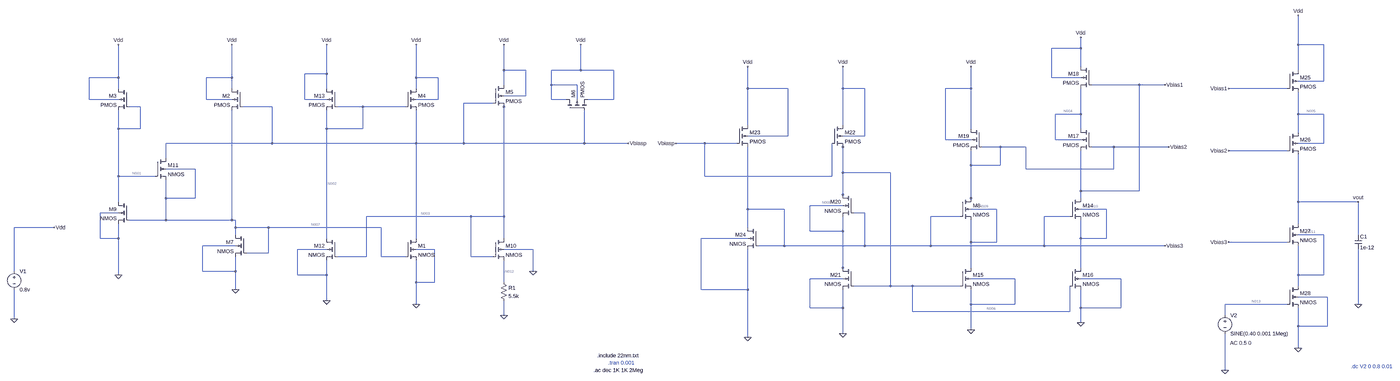
[diagram p0: schematic 22nm_Circuit.asc, whole sheet]
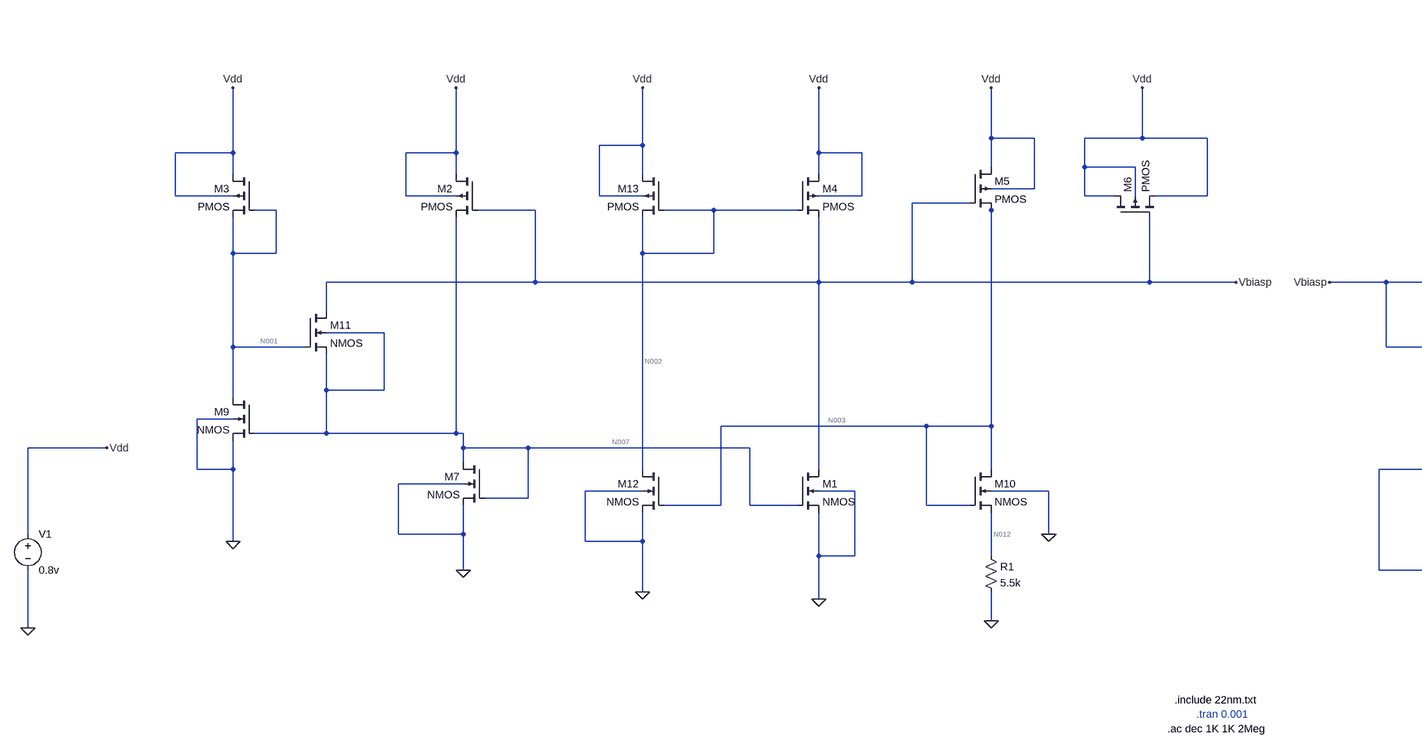
[diagram p1: schematic 22nm_Circuit.asc, part, row 1 of 1, column 1 of 2]
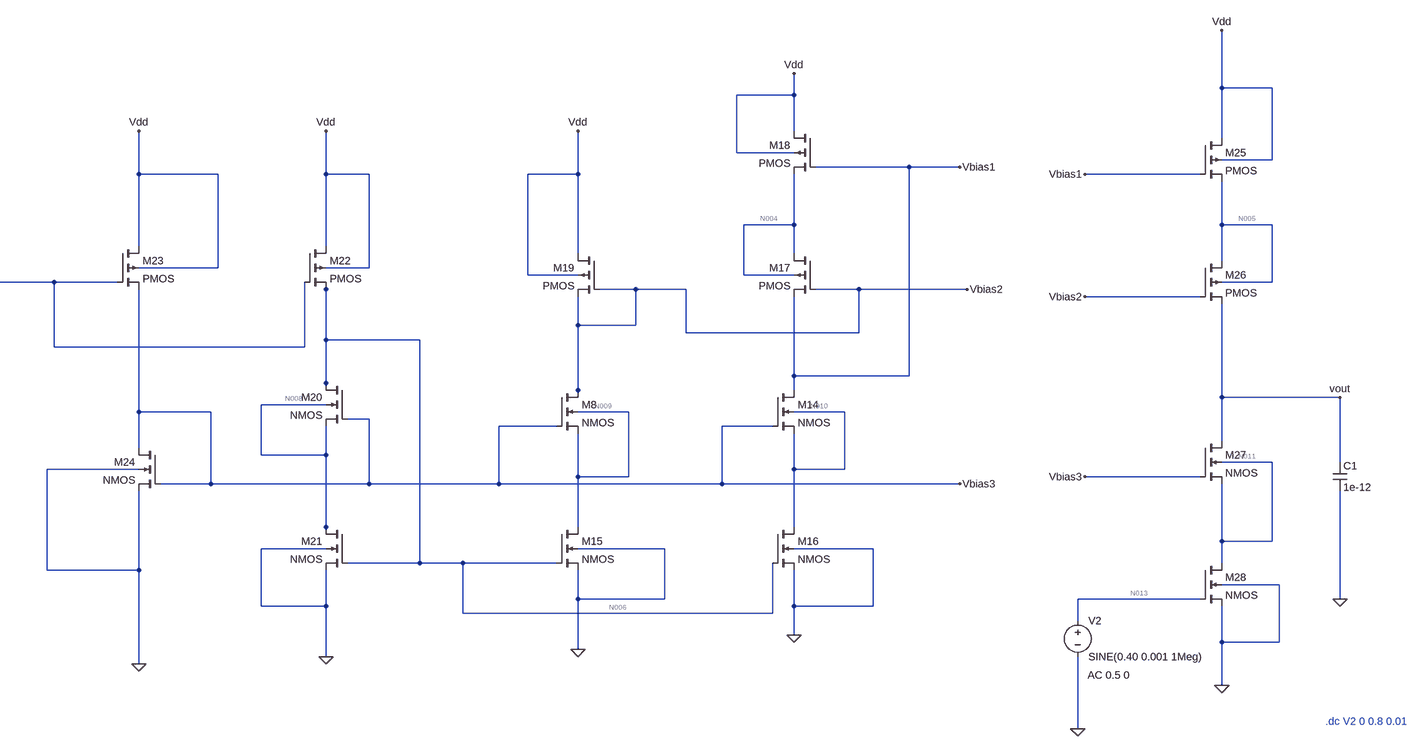
[diagram p2: schematic 22nm_Circuit.asc, part, row 1 of 1, column 2 of 2]
22nm_Circuit.asc, the LTspice schematic file:
Version 4
SHEET 1 9412 4424
WIRE 5104 240 5104 112
WIRE 5216 240 5104 240
WIRE 4112 256 4112 208
WIRE 4112 256 3984 256
WIRE 4112 336 4112 256
WIRE 1520 352 1520 240
WIRE 1616 352 1520 352
WIRE 1856 352 1856 240
WIRE 1856 352 1728 352
WIRE 2000 352 1856 352
WIRE 5104 352 5104 240
WIRE 672 368 672 240
WIRE 672 368 576 368
WIRE -320 384 -320 240
WIRE -320 384 -448 384
WIRE 176 384 176 240
WIRE 176 384 64 384
WIRE 1072 384 1072 240
WIRE 1168 384 1072 384
WIRE 3984 384 3984 256
WIRE 4112 384 3984 384
WIRE 5216 400 5216 240
WIRE 5216 400 5104 400
WIRE 1520 416 1520 352
WIRE 1728 416 1728 352
WIRE 1840 416 1728 416
WIRE 4368 416 4160 416
WIRE 4512 416 4368 416
WIRE -320 432 -320 384
WIRE 176 432 176 384
WIRE 672 432 672 368
WIRE 1072 432 1072 384
WIRE 2656 432 2656 336
WIRE 2832 432 2656 432
WIRE 3072 432 3072 336
WIRE 3168 432 3072 432
WIRE 3632 432 3632 336
WIRE 3632 432 3520 432
WIRE 5056 432 4800 432
WIRE 1616 464 1616 352
WIRE 1616 464 1520 464
WIRE -448 480 -448 384
WIRE -320 480 -448 480
WIRE 64 480 64 384
WIRE 176 480 64 480
WIRE 576 480 576 368
WIRE 672 480 576 480
WIRE 1168 480 1168 384
WIRE 1168 480 1072 480
WIRE 1728 480 1728 416
WIRE 1792 480 1728 480
WIRE 1840 480 1840 416
WIRE 2000 480 2000 352
WIRE 2000 480 1888 480
WIRE 1472 496 1344 496
WIRE -224 512 -272 512
WIRE 352 512 224 512
WIRE 832 512 720 512
WIRE 1024 512 832 512
WIRE 1520 512 1520 496
WIRE 4112 544 4112 432
WIRE 4112 544 4000 544
WIRE 5104 544 5104 448
WIRE 5216 544 5104 544
WIRE 2656 592 2656 432
WIRE 3072 592 3072 432
WIRE -320 608 -320 528
WIRE -224 608 -224 512
WIRE -224 608 -320 608
WIRE 672 608 672 528
WIRE 832 608 832 512
WIRE 832 608 672 608
WIRE 3632 608 3632 432
WIRE 4112 608 4112 544
WIRE 5104 624 5104 544
WIRE 2832 640 2832 432
WIRE 2832 640 2656 640
WIRE 3168 640 3168 432
WIRE 3168 640 3072 640
WIRE 3520 656 3520 432
WIRE 3632 656 3520 656
WIRE 4000 656 4000 544
WIRE 4112 656 4000 656
WIRE 352 672 352 512
WIRE 352 672 -112 672
WIRE 1072 672 1072 528
WIRE 1072 672 352 672
WIRE 1344 672 1344 496
WIRE 1344 672 1072 672
WIRE 1872 672 1872 528
WIRE 1872 672 1344 672
WIRE 2064 672 1872 672
WIRE 2448 672 2272 672
WIRE 2608 672 2448 672
WIRE 5216 672 5216 544
WIRE 5216 672 5104 672
WIRE 3072 688 3072 672
WIRE 3760 688 3680 688
WIRE 3872 688 3760 688
WIRE 4256 688 4160 688
WIRE 4528 688 4256 688
WIRE 5056 704 4800 704
WIRE -112 736 -112 672
WIRE 3632 768 3632 704
WIRE 3760 768 3760 688
WIRE 3760 768 3632 768
WIRE 16 784 -112 784
WIRE 3872 784 3872 688
WIRE 4256 784 4256 688
WIRE 4256 784 3872 784
WIRE 3072 800 3072 688
WIRE 3280 800 3072 800
WIRE -320 816 -320 608
WIRE -160 816 -320 816
WIRE 2448 816 2448 672
WIRE 3024 816 3024 672
WIRE 3024 816 2448 816
WIRE 4112 880 4112 704
WIRE 4368 880 4368 416
WIRE 4368 880 4112 880
WIRE 3072 896 3072 800
WIRE -112 912 -112 832
WIRE 16 912 16 784
WIRE 16 912 -112 912
WIRE 3072 912 3072 896
WIRE 3632 912 3632 768
WIRE 4112 912 4112 880
WIRE -320 928 -320 816
WIRE 3632 928 3632 912
WIRE 5104 928 5104 720
WIRE 5520 928 5104 928
WIRE 3072 944 2928 944
WIRE 2656 960 2656 688
WIRE 2816 960 2656 960
WIRE 3744 960 3632 960
WIRE 4224 960 4112 960
WIRE -320 976 -400 976
WIRE 3168 976 3120 976
WIRE 1376 992 848 992
WIRE 1520 992 1520 512
WIRE 1520 992 1376 992
WIRE 3584 992 3456 992
WIRE 4064 992 3952 992
WIRE -112 1008 -112 912
WIRE -112 1008 -272 1008
WIRE 176 1008 176 528
WIRE 176 1008 -112 1008
WIRE 192 1008 176 1008
WIRE 5104 1024 5104 928
WIRE -912 1040 -1264 1040
WIRE 192 1040 192 1008
WIRE 336 1040 192 1040
WIRE 912 1040 336 1040
WIRE 2656 1040 2656 960
WIRE 2928 1056 2928 944
WIRE 3072 1056 3072 992
WIRE 3072 1056 2928 1056
WIRE 192 1072 192 1040
WIRE 5216 1072 5104 1072
WIRE 5520 1072 5520 928
WIRE -400 1088 -400 976
WIRE -320 1088 -320 1024
WIRE -320 1088 -400 1088
WIRE 672 1088 672 608
WIRE 1072 1088 1072 672
WIRE 1520 1088 1520 992
WIRE 2656 1088 2432 1088
WIRE 4112 1088 4112 1008
WIRE 4224 1088 4224 960
WIRE 4224 1088 4112 1088
WIRE 3632 1104 3632 1008
WIRE 3744 1104 3744 960
WIRE 3744 1104 3632 1104
WIRE 5056 1104 4800 1104
WIRE 192 1120 48 1120
WIRE 2816 1120 2816 960
WIRE 2816 1120 2704 1120
WIRE 3168 1120 3168 976
WIRE 3168 1120 2816 1120
WIRE 3456 1120 3456 992
WIRE 3456 1120 3168 1120
WIRE 3952 1120 3952 992
WIRE 3952 1120 3456 1120
WIRE 4512 1120 3952 1120
WIRE 672 1136 544 1136
WIRE 1152 1136 1072 1136
WIRE 1648 1136 1520 1136
WIRE 336 1152 336 1040
WIRE 336 1152 240 1152
WIRE 848 1168 848 992
WIRE 848 1168 720 1168
WIRE 912 1168 912 1040
WIRE 1024 1168 912 1168
WIRE 1376 1168 1376 992
WIRE 1472 1168 1376 1168
WIRE 3072 1216 3072 1056
WIRE 3632 1216 3632 1104
WIRE 4112 1216 4112 1088
WIRE -1264 1232 -1264 1040
WIRE 48 1232 48 1120
WIRE 192 1232 192 1168
WIRE 192 1232 48 1232
WIRE 1648 1232 1648 1136
WIRE 3072 1232 3072 1216
WIRE -320 1248 -320 1088
WIRE 544 1248 544 1136
WIRE 672 1248 672 1184
WIRE 672 1248 544 1248
WIRE 5104 1248 5104 1120
WIRE 5216 1248 5216 1072
WIRE 5216 1248 5104 1248
WIRE 3072 1264 2928 1264
WIRE 3824 1264 3632 1264
WIRE 4288 1264 4112 1264
WIRE 1072 1280 1072 1184
WIRE 1152 1280 1152 1136
WIRE 1152 1280 1072 1280
WIRE 1520 1280 1520 1184
WIRE 3280 1296 3280 800
WIRE 3280 1296 3120 1296
WIRE 3376 1296 3280 1296
WIRE 3584 1296 3376 1296
WIRE 5104 1296 5104 1248
WIRE 192 1312 192 1232
WIRE 2432 1312 2432 1088
WIRE 2656 1312 2656 1136
WIRE 2656 1312 2432 1312
WIRE 5232 1344 5104 1344
WIRE 672 1360 672 1248
WIRE 1072 1376 1072 1280
WIRE 3632 1376 3632 1312
WIRE 3824 1376 3824 1264
WIRE 3824 1376 3632 1376
WIRE 5056 1376 4784 1376
WIRE 5520 1376 5520 1136
WIRE 2928 1392 2928 1264
WIRE 3072 1392 3072 1312
WIRE 3072 1392 2928 1392
WIRE 4112 1392 4112 1312
WIRE 4288 1392 4288 1264
WIRE 4288 1392 4112 1392
WIRE 3376 1408 3376 1296
WIRE 4064 1408 4064 1296
WIRE 4064 1408 3376 1408
WIRE 1520 1424 1520 1360
WIRE 4784 1424 4784 1376
WIRE -1264 1440 -1264 1312
WIRE 4112 1456 4112 1392
WIRE 5104 1472 5104 1392
WIRE 5232 1472 5232 1344
WIRE 5232 1472 5104 1472
WIRE 3632 1488 3632 1376
WIRE 3072 1504 3072 1392
WIRE 2656 1520 2656 1312
WIRE 5104 1568 5104 1472
WIRE 4784 1664 4784 1504
FLAG 192 1312 0
FLAG -320 1248 0
FLAG 672 1360 0
FLAG 1072 1376 0
FLAG 1520 1424 0
FLAG -1264 1440 0
FLAG -912 1040 Vdd
FLAG -320 240 Vdd
FLAG 176 240 Vdd
FLAG 672 240 Vdd
FLAG 1072 240 Vdd
FLAG 1520 240 Vdd
FLAG 1856 240 Vdd
FLAG 1648 1232 0
FLAG 3632 1488 0
FLAG 4112 1456 0
FLAG 3072 1504 0
FLAG 2656 1520 0
FLAG 2656 336 Vdd
FLAG 3072 336 Vdd
FLAG 3632 336 Vdd
FLAG 4112 208 Vdd
FLAG 4512 416 Vbias1
FLAG 4528 688 Vbias2
FLAG 4512 1120 Vbias3
FLAG 2064 672 Vbiasp
FLAG 5104 1568 0
FLAG 4784 1664 0
FLAG 5520 1376 0
FLAG 4800 432 Vbias1
FLAG 4800 704 Vbias2
FLAG 4800 1104 Vbias3
FLAG 5104 112 Vdd
FLAG 2272 672 Vbiasp
FLAG 5520 928 vout
SYMBOL pmos4 224 432 M0
SYMATTR InstName M2
SYMATTR Value2 l=22n w=264n
SYMBOL pmos4 -272 432 M0
SYMATTR InstName M3
SYMATTR Value2 l=44n w=22n
SYMBOL pmos4 1024 432 R0
SYMATTR InstName M4
SYMATTR Value2 l=22n w=264n
SYMBOL pmos4 1472 416 R0
SYMATTR InstName M5
SYMATTR Value2 l=22n w=264n
SYMBOL pmos4 1792 528 R270
SYMATTR InstName M6
SYMATTR Value2 l=22n w=22n
SYMBOL nmos4 240 1072 M0
SYMATTR InstName M7
SYMATTR Value2 l=22n w=110n
SYMBOL nmos4 -272 928 M0
SYMATTR InstName M9
SYMATTR Value2 l=22n w=110n
SYMBOL nmos4 1472 1088 R0
SYMATTR InstName M10
SYMATTR Value2 l=22n w=330n
SYMBOL nmos4 -160 736 R0
SYMATTR InstName M11
SYMATTR Value2 l=22n w=44n
SYMBOL nmos4 1024 1088 R0
SYMATTR InstName M1
SYMATTR Value2 l=22n w=110n
SYMBOL nmos4 720 1088 M0
SYMATTR InstName M12
SYMATTR Value2 l=22n w=110n
SYMBOL pmos4 720 432 M0
SYMATTR InstName M13
SYMATTR Value2 l=22n w=264n
SYMBOL voltage -1264 1216 R0
WINDOW 123 0 0 Left 0
WINDOW 39 0 0 Left 0
SYMATTR InstName V1
SYMATTR Value 0.8v
SYMBOL res 1504 1264 R0
SYMATTR InstName R1
SYMATTR Value 5.5k
SYMBOL nmos4 3584 912 R0
SYMATTR InstName M8
SYMATTR Value2 l=44n w=220n
SYMBOL nmos4 4064 912 R0
SYMATTR InstName M14
SYMATTR Value2 l=44n w=220n
SYMBOL nmos4 3584 1216 R0
SYMATTR InstName M15
SYMATTR Value2 l=44n w=220n
SYMBOL nmos4 4064 1216 R0
SYMATTR InstName M16
SYMATTR Value2 l=44n w=220n
SYMBOL pmos4 4160 608 M0
SYMATTR InstName M17
SYMATTR Value2 l=44n w=528n
SYMBOL pmos4 4160 336 M0
SYMATTR InstName M18
SYMATTR Value2 l=44n w=528n
SYMBOL pmos4 3680 608 M0
SYMATTR InstName M19
SYMATTR Value2 l=110n w=440n
SYMBOL nmos4 3120 896 M0
SYMATTR InstName M20
SYMATTR Value2 l=44n w=220n
SYMBOL nmos4 3120 1216 M0
SYMATTR InstName M21
SYMATTR Value2 l=44n w=220n
SYMBOL pmos4 3024 592 R0
SYMATTR InstName M22
SYMATTR Value2 l=44n w=528n
SYMBOL pmos4 2608 592 R0
SYMATTR InstName M23
SYMATTR Value2 l=44n w=528n
SYMBOL nmos4 2704 1040 M0
SYMATTR InstName M24
SYMATTR Value2 l=44n w=110n
SYMBOL pmos4 5056 352 R0
SYMATTR InstName M25
SYMATTR Value2 l=44n w=528n
SYMBOL pmos4 5056 624 R0
SYMATTR InstName M26
SYMATTR Value2 l=44n w=528n
SYMBOL nmos4 5056 1024 R0
SYMATTR InstName M27
SYMATTR Value2 l=44n w=220n
SYMBOL nmos4 5056 1296 R0
SYMATTR InstName M28
SYMATTR Value2 l=44n w=220n
SYMBOL voltage 4784 1408 R0
WINDOW 123 22 137 Left 2
WINDOW 39 0 0 Left 0
SYMATTR Value2 AC 0.5 0
SYMATTR InstName V2
SYMATTR Value SINE(0.40 0.001 1Meg)
SYMBOL cap 5504 1072 R0
SYMATTR InstName C1
SYMATTR Value 1e-12
TEXT 1928 1600 Left 2 !.include 22nm.txt
TEXT 1912 1664 Left 2 !.ac dec 1K 1K 2Meg
TEXT 1976 1632 Left 2 ;.tran 0.001
TEXT 5488 1648 Left 2 ;.dc V2 0 0.8 0.01

The netlist it stands for:
* 22nm_Circuit.asc
M2 Vdd Vbiasp N007 Vdd PMOS l=22n w=264n
M3 Vdd N001 N001 Vdd PMOS l=44n w=22n
M4 Vdd N002 Vbiasp Vdd PMOS l=22n w=264n
M5 Vdd Vbiasp N003 Vdd PMOS l=22n w=264n
M6 Vdd Vbiasp Vdd Vdd PMOS l=22n w=22n
M7 N007 N007 0 0 NMOS l=22n w=110n
M9 N001 N007 0 0 NMOS l=22n w=110n
M10 N003 N003 N012 0 NMOS l=22n w=330n
M11 Vbiasp N001 N007 N007 NMOS l=22n w=44n
M1 Vbiasp N007 0 0 NMOS l=22n w=110n
M12 N002 N003 0 0 NMOS l=22n w=110n
M13 Vdd N002 N002 Vdd PMOS l=22n w=264n
V1 Vdd 0 0.8v
R1 N012 0 5.5k
M8 Vbias2 Vbias3 N009 N009 NMOS l=44n w=220n
M14 Vbias1 Vbias3 N010 N010 NMOS l=44n w=220n
M15 N009 N006 0 0 NMOS l=44n w=220n
M16 N010 N006 0 0 NMOS l=44n w=220n
M17 N004 Vbias2 Vbias1 N004 PMOS l=44n w=528n
M18 Vdd Vbias1 N004 Vdd PMOS l=44n w=528n
M19 Vdd Vbias2 Vbias2 Vdd PMOS l=110n w=440n
M20 N006 Vbias3 N008 N008 NMOS l=44n w=220n
M21 N008 N006 0 0 NMOS l=44n w=220n
M22 Vdd Vbiasp N006 Vdd PMOS l=44n w=528n
M23 Vdd Vbiasp Vbias3 Vdd PMOS l=44n w=528n
M24 Vbias3 Vbias3 0 0 NMOS l=44n w=110n
M25 Vdd Vbias1 N005 Vdd PMOS l=44n w=528n
M26 N005 Vbias2 vout N005 PMOS l=44n w=528n
M27 vout Vbias3 N011 N011 NMOS l=44n w=220n
M28 N011 N013 0 0 NMOS l=44n w=220n
V2 N013 0 SINE(0.40 0.001 1Meg) AC 0.5 0
C1 vout 0 1e-12
.model NMOS NMOS
.model PMOS PMOS
.lib standard.mos
.include 22nm.txt
.ac dec 1K 1K 2Meg
* .tran 0.001
* .dc V2 0 0.8 0.01
.backanno
.end

* Results of the author's LTspice run, read from the files saved beside the schematic
* Operating Point, zero values left out:
*   V(vdd) = 800 mV
*   V(vbiasp) = 415.9 mV
*   V(n007) = 409.2 mV
*   V(n001) = 62.51 mV
*   V(n002) = 412.4 mV
*   V(n003) = 411.2 mV
*   V(n012) = 49.64 mV
*   V(vbias2) = 344.6 mV
*   V(vbias3) = 415.4 mV
*   V(n009) = 32.53 mV
*   V(vbias1) = 402.9 mV
*   V(n010) = 33.29 mV
*   V(n006) = 404.9 mV
*   V(n004) = 730.6 mV
*   V(n008) = 33.31 mV
*   V(n005) = 735.9 mV
*   V(vout) = 601.8 mV
*   V(n011) = 38.76 mV
*   V(n013) = 400 mV
*   Id(M2) = 9.115 µA
*   Is(M2) = -9.115 µA
*   Id(M3) = 1.797 µA
*   Is(M3) = -1.797 µA
*   Id(M4) = 9.344 µA
*   Is(M4) = -9.344 µA
*   Id(M5) = 9.026 µA
*   Is(M5) = -9.026 µA
*   Id(M13) = 9.502 µA
*   Is(M13) = -9.502 µA
*   Id(M17) = 442.5 nA
*   Is(M17) = -442.5 nA
*   Id(M18) = 442.5 nA
*   Is(M18) = -442.5 nA
*   Id(M19) = 436.8 nA
*   Is(M19) = -436.8 nA
*   Id(M22) = 442.7 nA
*   Is(M22) = -442.7 nA
*   Id(M23) = 439.8 nA
*   Is(M23) = -439.8 nA
*   Id(M25) = 433.2 nA
*   Is(M25) = -433.2 nA
*   Id(M26) = 433.2 nA
*   Is(M26) = -433.2 nA
*   Id(M7) = 9.115 µA
*   Is(M7) = -9.115 µA
*   Id(M9) = 1.797 µA
*   Ig(M9) = 1.361 pA
*   Is(M9) = -1.797 µA
*   Id(M10) = 9.026 µA
*   Ig(M10) = 1.807 pA
*   Is(M10) = -9.026 µA
*   Ig(M11) = -1.739 pA
*   Id(M1) = 9.344 µA
*   Is(M1) = -9.344 µA
*   Id(M12) = 9.502 µA
*   Is(M12) = -9.502 µA
*   Id(M8) = 436.8 nA
*   Ig(M8) = 1.564 pA
*   Is(M8) = -436.8 nA
*   Id(M14) = 442.5 nA
*   Ig(M14) = 1.497 pA
*   Is(M14) = -442.5 nA
*   Id(M15) = 436.8 nA
*   Ig(M15) = 3.144 pA
*   Is(M15) = -436.8 nA
*   Id(M16) = 442.5 nA
*   Ig(M16) = 3.135 pA
*   Is(M16) = -442.5 nA
*   Id(M20) = 442.7 nA
*   Ig(M20) = 1.493 pA
*   Is(M20) = -442.7 nA
*   Id(M21) = 442.7 nA
*   Ig(M21) = 3.134 pA
*   Is(M21) = -442.7 nA
*   Id(M24) = 439.8 nA
*   Is(M24) = -439.8 nA
*   Id(M27) = 433.2 nA
*   Is(M27) = -433.2 nA
*   Id(M28) = 433.2 nA
*   Ig(M28) = 2.926 pA
*   Is(M28) = -433.2 nA
*   I(R1) = 9.026 µA
*   I(V1) = -40.98 µA
*   I(V2) = -2.926 pA